# Altium project ProjetoBotao.PrjPcb (part 4 of 4)
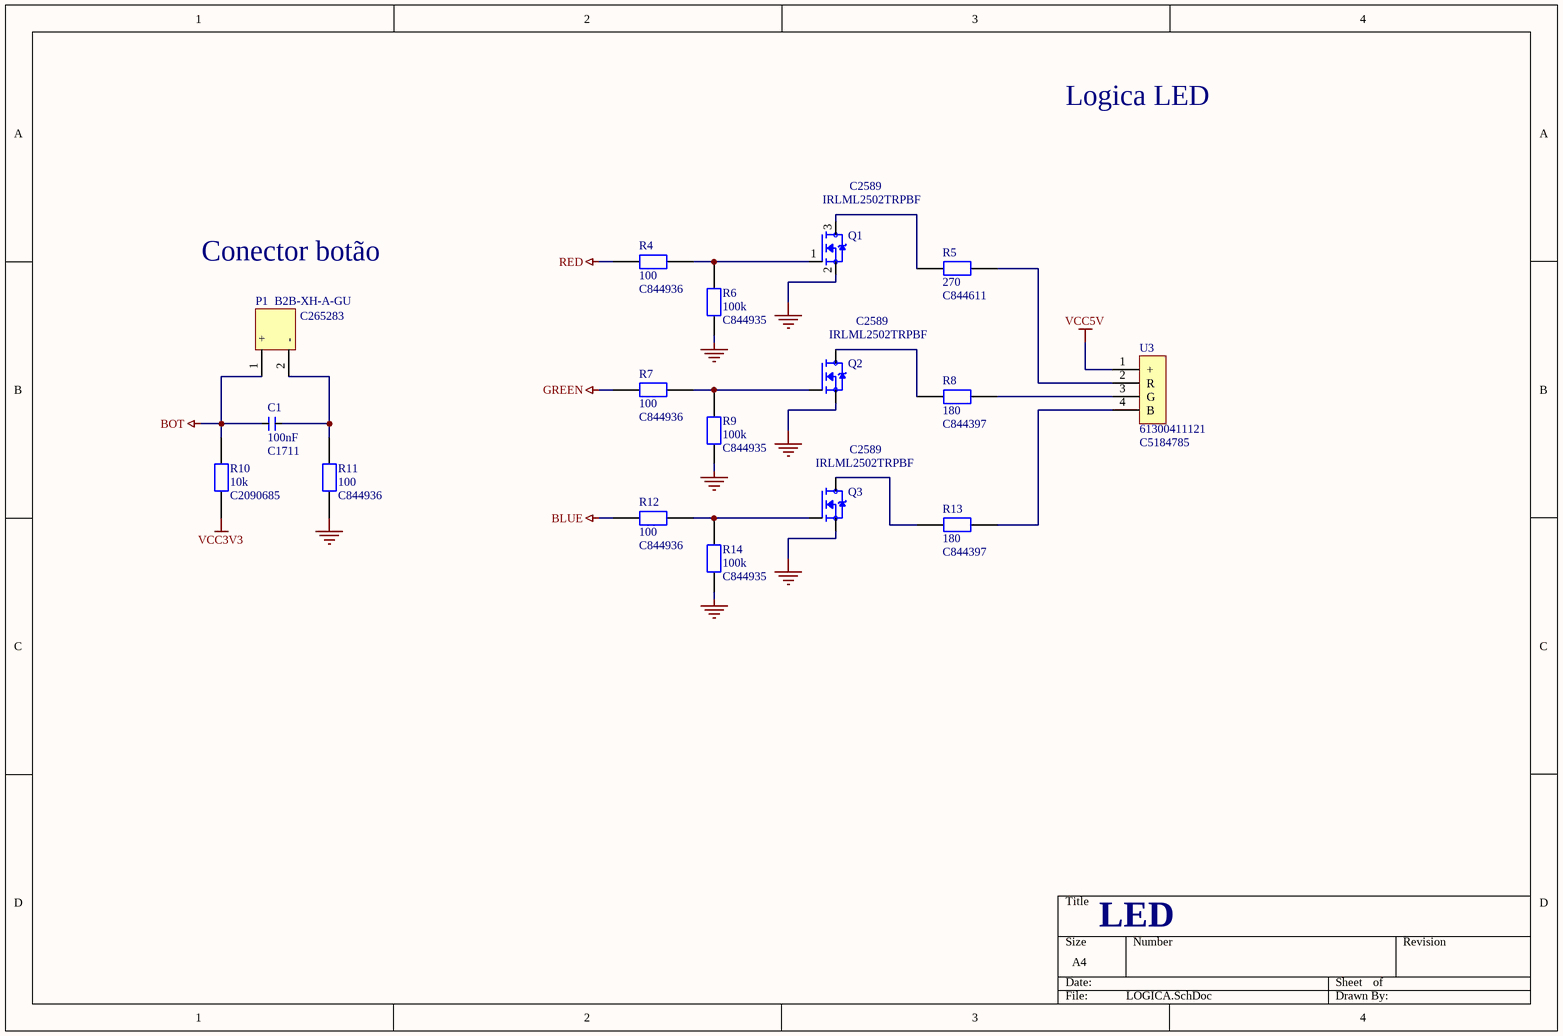
[diagram p5: LOGICA.SchDoc]

## Nets that join several sheets
BLUE: Micro (U4.27), LOGICA (R12.1)
BOT: Micro (U4.2), LOGICA (C1.1 P1.1 R10.2)
DTR: Micro (U4.10), BLUETOOH (R3.1)
EN: Micro (U4.29), BLUETOOH (U1.6)
GND: Micro (15 pins), BLUETOOH (U1.4 U2.5), POWER (5 pins), LOGICA (7 pins)
GREEN: Micro (U4.26), LOGICA (R7.1)
RED: Micro (U4.25), LOGICA (R4.1)
RX: Micro (U4.31), BLUETOOH (U1.3)
RX3: Micro (U4.22), BLUETOOH (U2.4)
STATE: Micro (U4.32), BLUETOOH (U1.1)
TX: Micro (U4.30), BLUETOOH (U1.2)
TX3: Micro (U4.21), BLUETOOH (U2.3)
VCC3V3: Micro (15 pins), BLUETOOH (R1.1), POWER (C11.1 U6.3), LOGICA (R10.1)
VCC5V: BLUETOOH (R2.2 U1.5), POWER (C10.1 U5.2 U6.1), LOGICA (U3.1)